# Altium schematic sheet CW342_FPGIO_2.SchDoc: <Enter Sheet Title>
size Letter; Organization: NewAE Technology Inc.; Address1: 1083 Queen St., Suite 196; Address2: Halifax; Address3: NS; Address4: Canada B3H 0B2; SheetNumber: 4; SheetTotal: 9; SheetApproved: NO
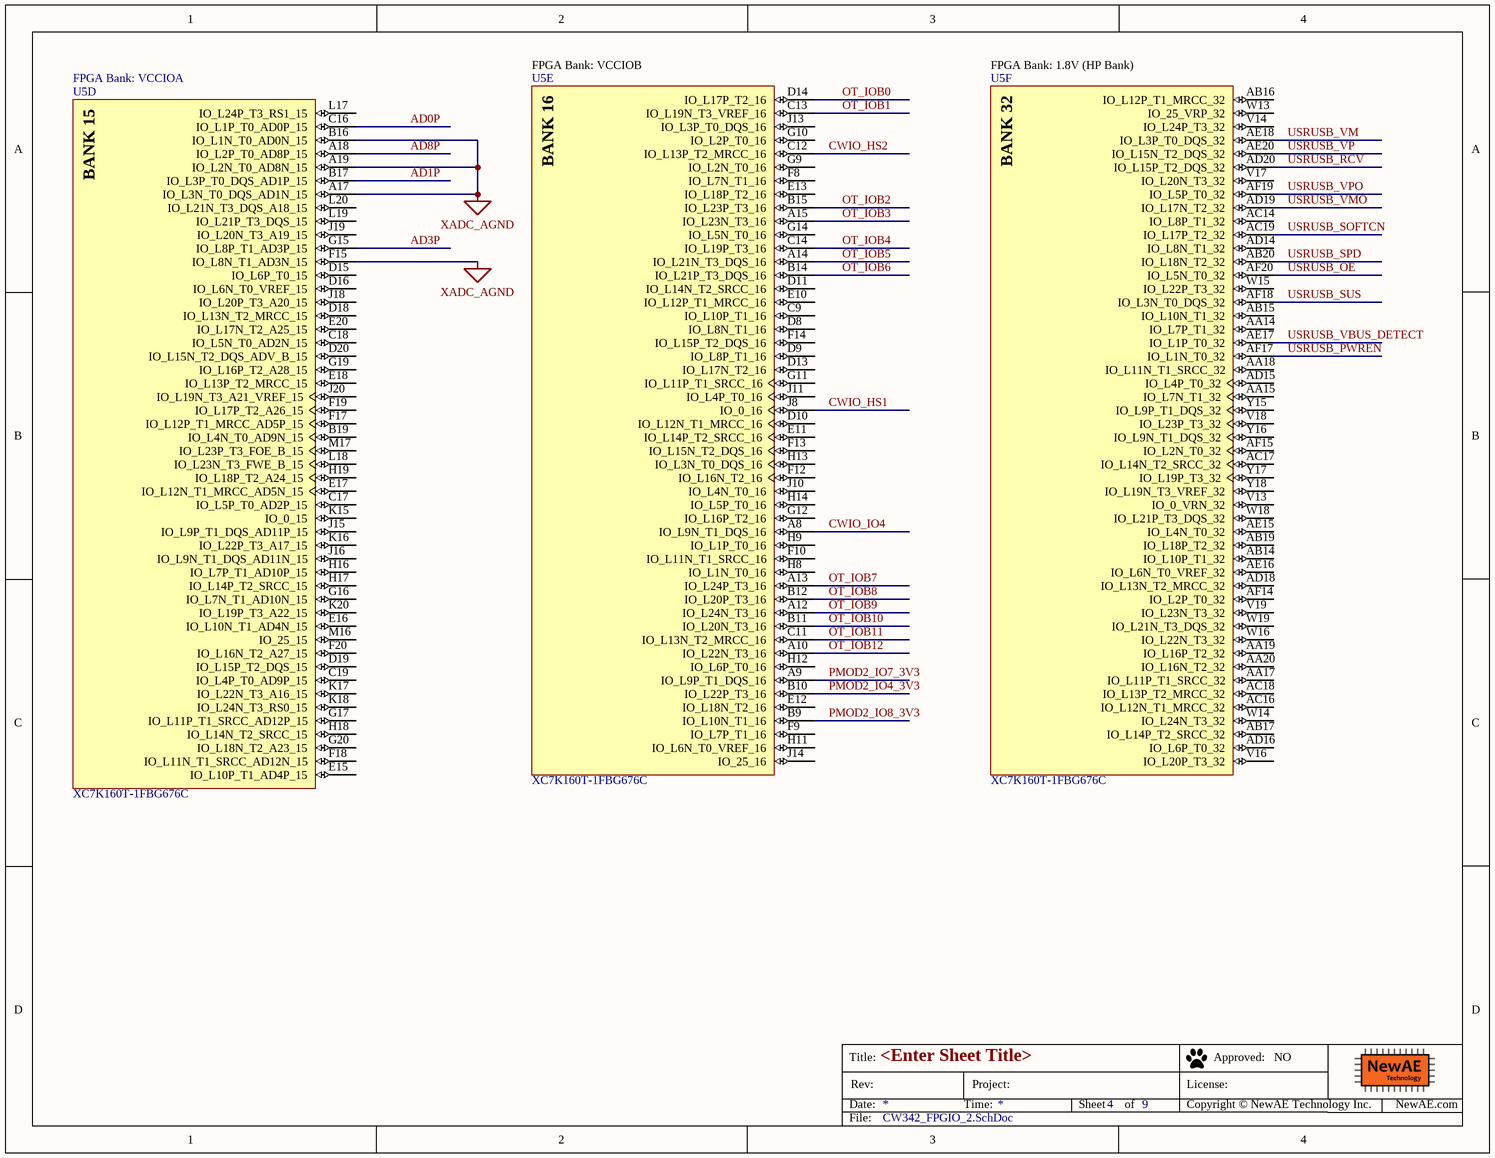
[diagram p0: CW342_FPGIO_2.SchDoc]

## Parts
U5  XC7K160T-1FBG676C  [FBG676]  (parts D,E,F of 14)

## Nets
XADC_AGND: U5.A17(IO_L3N_T0_DQS_AD1N_15) U5.A19(IO_L2N_T0_AD8N_15) U5.B16(IO_L1N_T0_AD0N_15) U5.F15(IO_L8N_T1_AD3N_15)
AD0P: U5.C16(IO_L1P_T0_AD0P_15)
AD1P: U5.B17(IO_L3P_T0_DQS_AD1P_15)
AD3P: U5.G15(IO_L8P_T1_AD3P_15)
AD8P: U5.A18(IO_L2P_T0_AD8P_15)
CWIO_HS1: U5.J8(IO_0_16)
CWIO_HS2: U5.C12(IO_L13P_T2_MRCC_16)
CWIO_IO4: U5.A8(IO_L9N_T1_DQS_16)
OT_IOB0: U5.D14(IO_L17P_T2_16)
OT_IOB1: U5.C13(IO_L19N_T3_VREF_16)
OT_IOB2: U5.B15(IO_L23P_T3_16)
OT_IOB3: U5.A15(IO_L23N_T3_16)
OT_IOB4: U5.C14(IO_L19P_T3_16)
OT_IOB5: U5.A14(IO_L21N_T3_DQS_16)
OT_IOB6: U5.B14(IO_L21P_T3_DQS_16)
OT_IOB7: U5.A13(IO_L24P_T3_16)
OT_IOB8: U5.B12(IO_L20P_T3_16)
OT_IOB9: U5.A12(IO_L24N_T3_16)
OT_IOB10: U5.B11(IO_L20N_T3_16)
OT_IOB11: U5.C11(IO_L13N_T2_MRCC_16)
OT_IOB12: U5.A10(IO_L22N_T3_16)
PMOD2_IO4_3V3: U5.B10(IO_L22P_T3_16)
PMOD2_IO7_3V3: U5.A9(IO_L9P_T1_DQS_16)
PMOD2_IO8_3V3: U5.B9(IO_L10N_T1_16)
USRUSB_OE: U5.AF20(IO_L5N_T0_32)
USRUSB_PWREN: U5.AF17(IO_L1N_T0_32)
USRUSB_RCV: U5.AD20(IO_L15P_T2_DQS_32)
USRUSB_SOFTCN: U5.AC19(IO_L17P_T2_32)
USRUSB_SPD: U5.AB20(IO_L18N_T2_32)
USRUSB_SUS: U5.AF18(IO_L3N_T0_DQS_32)
USRUSB_VBUS_DETECT: U5.AE17(IO_L1P_T0_32)
USRUSB_VM: U5.AE18(IO_L3P_T0_DQS_32)
USRUSB_VMO: U5.AD19(IO_L17N_T2_32)
USRUSB_VP: U5.AE20(IO_L15N_T2_DQS_32)
USRUSB_VPO: U5.AF19(IO_L5P_T0_32)

Not connected (* = marked no-connect by the designer): U5 AA14(IO_L7P_T1_32) AA15(IO_L7N_T1_32) AA17(IO_L11P_T1_SRCC_32) AA18(IO_L11N_T1_SRCC_32) AA19(IO_L16P_T2_32) AA20(IO_L16N_T2_32) AB14(IO_L10P_T1_32) AB15(IO_L10N_T1_32) AB16(IO_L12P_T1_MRCC_32) AB17(IO_L14P_T2_SRCC_32) AB19(IO_L18P_T2_32) AC14(IO_L8P_T1_32) AC16(IO_L12N_T1_MRCC_32) AC17(IO_L14N_T2_SRCC_32) AC18(IO_L13P_T2_MRCC_32) AD14(IO_L8N_T1_32) AD15(IO_L4P_T0_32) AD16(IO_L6P_T0_32) AD18(IO_L13N_T2_MRCC_32) AE15(IO_L4N_T0_32) AE16(IO_L6N_T0_VREF_32) AF14(IO_L2P_T0_32) AF15(IO_L2N_T0_32) B19(IO_L4N_T0_AD9N_15) C9(IO_L10P_T1_16) C17(IO_L5P_T0_AD2P_15) C18(IO_L5N_T0_AD2N_15) C19(IO_L4P_T0_AD9P_15) D8(IO_L8N_T1_16) D9(IO_L8P_T1_16) D10(IO_L12N_T1_MRCC_16) D11(IO_L14N_T2_SRCC_16) D13(IO_L17N_T2_16) D15(IO_L6P_T0_15) D16(IO_L6N_T0_VREF_15) D18(IO_L13N_T2_MRCC_15) D19(IO_L15P_T2_DQS_15) D20(IO_L15N_T2_DQS_ADV_B_15) E10(IO_L12P_T1_MRCC_16) E11(IO_L14P_T2_SRCC_16) E12(IO_L18N_T2_16) E13(IO_L18P_T2_16) E15(IO_L10P_T1_AD4P_15) E16(IO_L10N_T1_AD4N_15) E17(IO_L12N_T1_MRCC_AD5N_15) E18(IO_L13P_T2_MRCC_15) E20(IO_L17N_T2_A25_15) F8(IO_L7N_T1_16) F9(IO_L7P_T1_16) F10(IO_L11N_T1_SRCC_16) F12(IO_L16N_T2_16) F13(IO_L15N_T2_DQS_16) F14(IO_L15P_T2_DQS_16) F17(IO_L12P_T1_MRCC_AD5P_15) F18(IO_L11N_T1_SRCC_AD12N_15) F19(IO_L17P_T2_A26_15) F20(IO_L16N_T2_A27_15) G9(IO_L2N_T0_16) G10(IO_L2P_T0_16) G11(IO_L11P_T1_SRCC_16) G12(IO_L16P_T2_16) G14(IO_L5N_T0_16) G16(IO_L7N_T1_AD10N_15) G17(IO_L11P_T1_SRCC_AD12P_15) G19(IO_L16P_T2_A28_15) G20(IO_L18N_T2_A23_15) H8(IO_L1N_T0_16) H9(IO_L1P_T0_16) H11(IO_L6N_T0_VREF_16) H12(IO_L6P_T0_16) H13(IO_L3N_T0_DQS_16) H14(IO_L5P_T0_16) H16(IO_L7P_T1_AD10P_15) H17(IO_L14P_T2_SRCC_15) H18(IO_L14N_T2_SRCC_15) H19(IO_L18P_T2_A24_15) J10(IO_L4N_T0_16) J11(IO_L4P_T0_16) J13(IO_L3P_T0_DQS_16) J14(IO_25_16) J15(IO_L9P_T1_DQS_AD11P_15) J16(IO_L9N_T1_DQS_AD11N_15) J18(IO_L20P_T3_A20_15) J19(IO_L20N_T3_A19_15) J20(IO_L19N_T3_A21_VREF_15) K15(IO_0_15) K16(IO_L22P_T3_A17_15) K17(IO_L22N_T3_A16_15) K18(IO_L24N_T3_RS0_15) K20(IO_L19P_T3_A22_15) L17(IO_L24P_T3_RS1_15) L18(IO_L23N_T3_FWE_B_15) L19(IO_L21P_T3_DQS_15) L20(IO_L21N_T3_DQS_A18_15) M16(IO_25_15) M17(IO_L23P_T3_FOE_B_15) V13(IO_0_VRN_32) V14(IO_L24P_T3_32) V16(IO_L20P_T3_32) V17(IO_L20N_T3_32) V18(IO_L23P_T3_32) V19(IO_L23N_T3_32) W13(IO_25_VRP_32) W14(IO_L24N_T3_32) W15(IO_L22P_T3_32) W16(IO_L22N_T3_32) W18(IO_L21P_T3_DQS_32) W19(IO_L21N_T3_DQS_32) Y15(IO_L9P_T1_DQS_32) Y16(IO_L9N_T1_DQS_32) Y17(IO_L19P_T3_32) Y18(IO_L19N_T3_VREF_32)

## Notes on the sheet
- FPGA Bank: VCCIOA
- FPGA Bank: VCCIOB
- (near U5) FPGA Bank: 1.8V (HP Bank)
- Title:
- Date:
- Rev:
- Time:
- Project:
- Sheet
- of
- License:
- Copyright © NewAE Technology Inc.
- Approved:
- NewAE.com
- File:
- (in symbol CMP-0361-00025-2, part D) BANK 15
- (in symbol CMP-0361-00025-2, part E) BANK 16
- (in symbol CMP-0361-00025-2, part F) BANK 32

## Library data of the parts
U5 = CMP-0361-00025-2: Kintex-7 FPGA, 400 User I/Os, 8 GTX, 676-Ball BGA, Speed Grade 1, Commercial Grade, Pb-Free; Manufacturer: Xilinx; SelectIO HR: 250; GTX: 8; SelectIO HP: 150; Speed Grade: -1; RoHS: Pb-Free; PackageReference: FBG676; Code_JEDEC: MS-034; Mounting Technology: Surface Mount; ComponentLink1URL: http://www.xilinx.com/support/documentation/data_sheets/ds180_7Series_Overview.pdf; DatasheetVersion: v1.12; Generic Part Number: XC7K160T; PartNumber: XC7K160T-1FBG676C; PackageVersion: Rev 1.8; ComponentLink2URL: http://www.xilinx.com/support/documentation/user_guides/ug475_7Series_Pkg_Pinout.pdf; PackageDescription: Flip-Chip Lidless BGA, Body 27 x 27 mm, 1.0 mm Pitch; ComponentLink1Description: Datasheet; ComponentLink2Description: Package Specification